# Altium schematic sheet PowerModule.SchDoc: Y1701
size A3; Date: 20181219; Author: xianrui; CompanyName: 成都捷祥医疗器械有限公司; Revision: V2.0; SheetNumber: 1; SheetTotal: 1
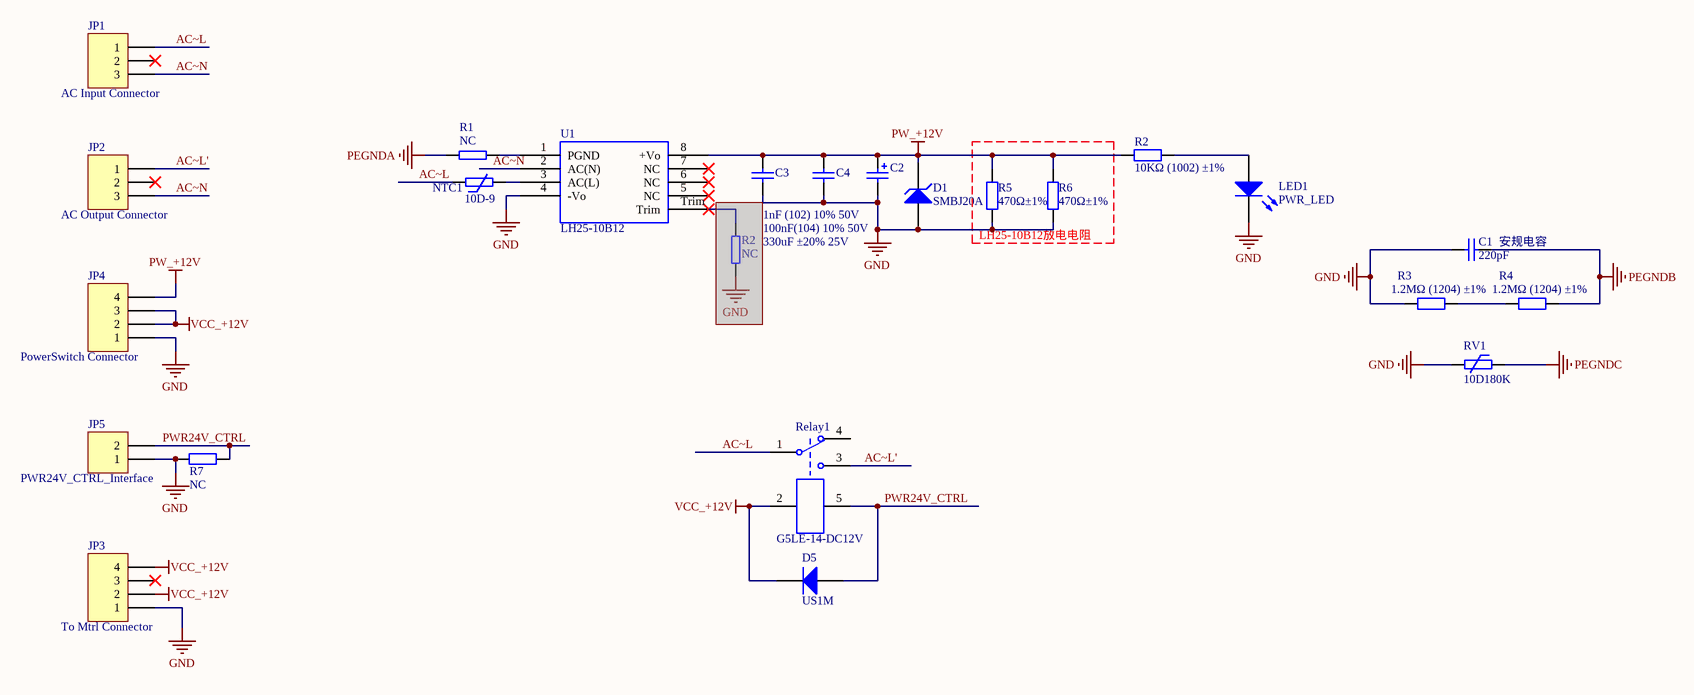
[diagram p0: PowerModule.SchDoc]

## Parts
(Parts that share a designator on the sheet are numbered #1, #2 ... from top to bottom, then left to right.)
C1  220pF  [RCC-DE1B3-ANGUI]
C2  330uF ±20% 25V  [RCC-AL-EC-8*10-TH]
C3  1nF (102) 10% 50V  [LC-0805_C]
C4  100nF(104) 10% 50V  [LC-0805_C]
D1  SMBJ20A  [LC-SMB(DO-214AA)_S1]
D5  US1M  [LC-SMA(DO-214AC)_S1]
JP1  AC Input Connector  [RCJ3.96-3CA-Isolate]
JP2  AC Output Connector  [RCJ3.96-3CA-Isolate]
JP3  To Mtrl Connector  [RCJ3.96-4CA]
JP4  PowerSwitch Connector  [RCJ3.96-4CA]
JP5  PWR24V_CTRL_Interface  [RCJ-XH2.54-2P]
LED1  PWR_LED  [LC-0603_LED_S1]
NTC1  10D-9  [RCR-NTC-10d-9]
R1  NC  [RCR2512TH]
R2#1  10KΩ (1002) ±1%  [LC-0603_R]
R2#2  NC  [LC-1206_R]  (masked out: inside a compile mask, not in the netlist)
R3  1.2MΩ (1204) ±1%  [LC-1206_R]
R4  1.2MΩ (1204) ±1%  [LC-1206_R]
R5  470Ω±1%  [RCR2512TH]
R6  470Ω±1%  [RCR2512TH]
R7  NC  [RCR0805TH]
Relay1  G5LE-14-DC12V  [RCRELAY-G5LE-14]
RV1  10D180K  [RCRV-10DXXXK]
U1  LH25-10B12  [RCPM-LH20-25-Mornsun]

## Blocks framed on the sheet
LH25-10B12放电电阻: R5 R6

## Nets
GND: C1.1 C2.2 C3.1 C4.2 D1.1(A) JP3.1 JP4.1 JP5.1 LED1.K R3.1 R5.1 R6.1 R7.2 RV1.2 U1.4(-Vo)
PEGNDA: R1.1
PEGNDB: C1.2 R4.2
PEGNDC: RV1.1
PW_+12V: C2.1 C3.2 C4.1 D1.2(K) JP4.4 R2#1.1 R5.2 R6.2 U1.8(+Vo)
VCC_+12V: D5.2(K) JP3.2 JP3.4 JP4.2 JP4.3 Relay1.2
AC~L: JP1.1 NTC1.1 Relay1.1
AC~L': JP2.1 Relay1.3
AC~N: JP1.3 JP2.3 U1.2(AC(N))
PWR24V_CTRL: D5.1(A) JP5.2 R7.1 Relay1.5
NetLED1_A: LED1.A R2#1.2
NetNTC1_2: NTC1.2 U1.3(AC(L))
NetR1_2: R1.2 U1.1(PGND)
NetR3_2: R3.2 R4.1

Not connected (* = marked no-connect by the designer): JP1 2*; JP2 2*; JP3 3*; Relay1 4; U1 5(NC)* 6(NC)* 7(NC)* Trim*

## Notes on the sheet
- (near C1) 安规电容
- 项目
- 时间
- 版本/修订
- 编制
- 第
- 审核
- 张
- 共
- 备注

## Library data of the parts
C1 = Cap_Nonpolar: 无极性电容; Manufacture: Murata; Ordering: DE1B3KX221KN4AP01F; Comments: 220pF; Libnum: *
C2 = Cap_polar: 有极性电容; Comments: 330uF ±20% 25V; Libnum: *; Manufacture: *; Ordering: *
C3 = 0805 1nF (102) 10% 50V: 贴片电容; ComponentLink1Description: 供应商链接; ComponentLink1URL: http://www.szlcsc.com/product/details_52223.html; Package: 0805; Supplier: LC; SuppliersPartNumber: C51210
C4 = 0805 100nF(104) 10% 50V: 贴片电容; ComponentLink1Description: 供应商链接; ComponentLink1URL: http://www.szlcsc.com/product/details_50686.html; Package: 0805; Supplier: LC; SuppliersPartNumber: C49678
D1 = DiodeA: Zener,Tvs; Manufacture: VISHAY; Comments: SMBJ20A; Libnum: *; Ordering: SMBJ20A
D5 = SMA(DO-214AC) US1M: 二极管; ComponentLink1Description: 供应商链接; ComponentLink1URL: http://www.szlcsc.com/product/details_5885.html; Package: SMA(DO-214AC); Supplier: LC; SuppliersPartNumber: C5441
JP1 JP2 = JCJ-1-3: 3 Pin 接插件; Lib: *; Manufacture: *; Ordering: *; LC: *
  JP1: Comments: AC Input Connector
  JP2: Comments: AC Output Connector
JP3 JP4 = Header 4: Header, 4-Pin; LatestRevisionDate: 17-Jul-2002; LatestRevisionNote: Re-released for DXP Platform.; Publisher: Altium Limited
  JP3: Comments: To Mtrl Connector
  JP4: Comments: PowerSwitch Connector
JP5 = Header 2: Header, 2-Pin; LatestRevisionDate: 17-Jul-2002; LatestRevisionNote: Re-released for DXP Platform.; Publisher: Altium Limited
LED1 = LEDA: Comments: PWR_LED; Libnum: *; Manufacture: *; Odering: *
NTC1 = NTC: NTC 浪涌抑制; Manufacture: RUILON(瑞隆源); Comments: 10D-9; Libnum: *; Ordering: 10D-9
R1 R2#2 = Res_Single_Lead: Manufacture: 厚声; Comments: NC; Libnum: *
R2#1 R7 = 0603 10KΩ (1002) 1%: 贴片电阻
  R2#1: ComponentLink1Description: 供应商链接; ComponentLink1URL: http://www.szlcsc.com/product/details_26547.html; Package: 0603; Supplier: LC; SuppliersPartNumber: C25804
R3-R6 = 1206 1.2MΩ (1204) 1%: 贴片电阻; ComponentLink1Description: 供应商链接; Supplier: LC
  R3 R4: ComponentLink1URL: https://item.szlcsc.com/260278.html; Package: 1206; SuppliersPartNumber: C270898
  R5 R6: ComponentLink1URL: https://item.szlcsc.com/327677.html; SuppliersPartNumber: C351718
Relay1 = G5LE: Relay; Manufacture: Ormon; Comments: G5LE-14-DC12V; Libnum: *; Ordering: G5LE-14-DC12V
RV1 = RV: 压敏电阻 浪涌抑制; Manufacture: RUILON; Comments: 10D180K; Libnum: *; Ordering: 10D180K
U1 = LH20(25): Mornsun 20(25)W AC-DC模块电源; Comments: LH25-10B12; Libnum: *; Manufacture: Mornsun; Ordering: LH25-10B12